# Altium project 解调板.PrjPCB
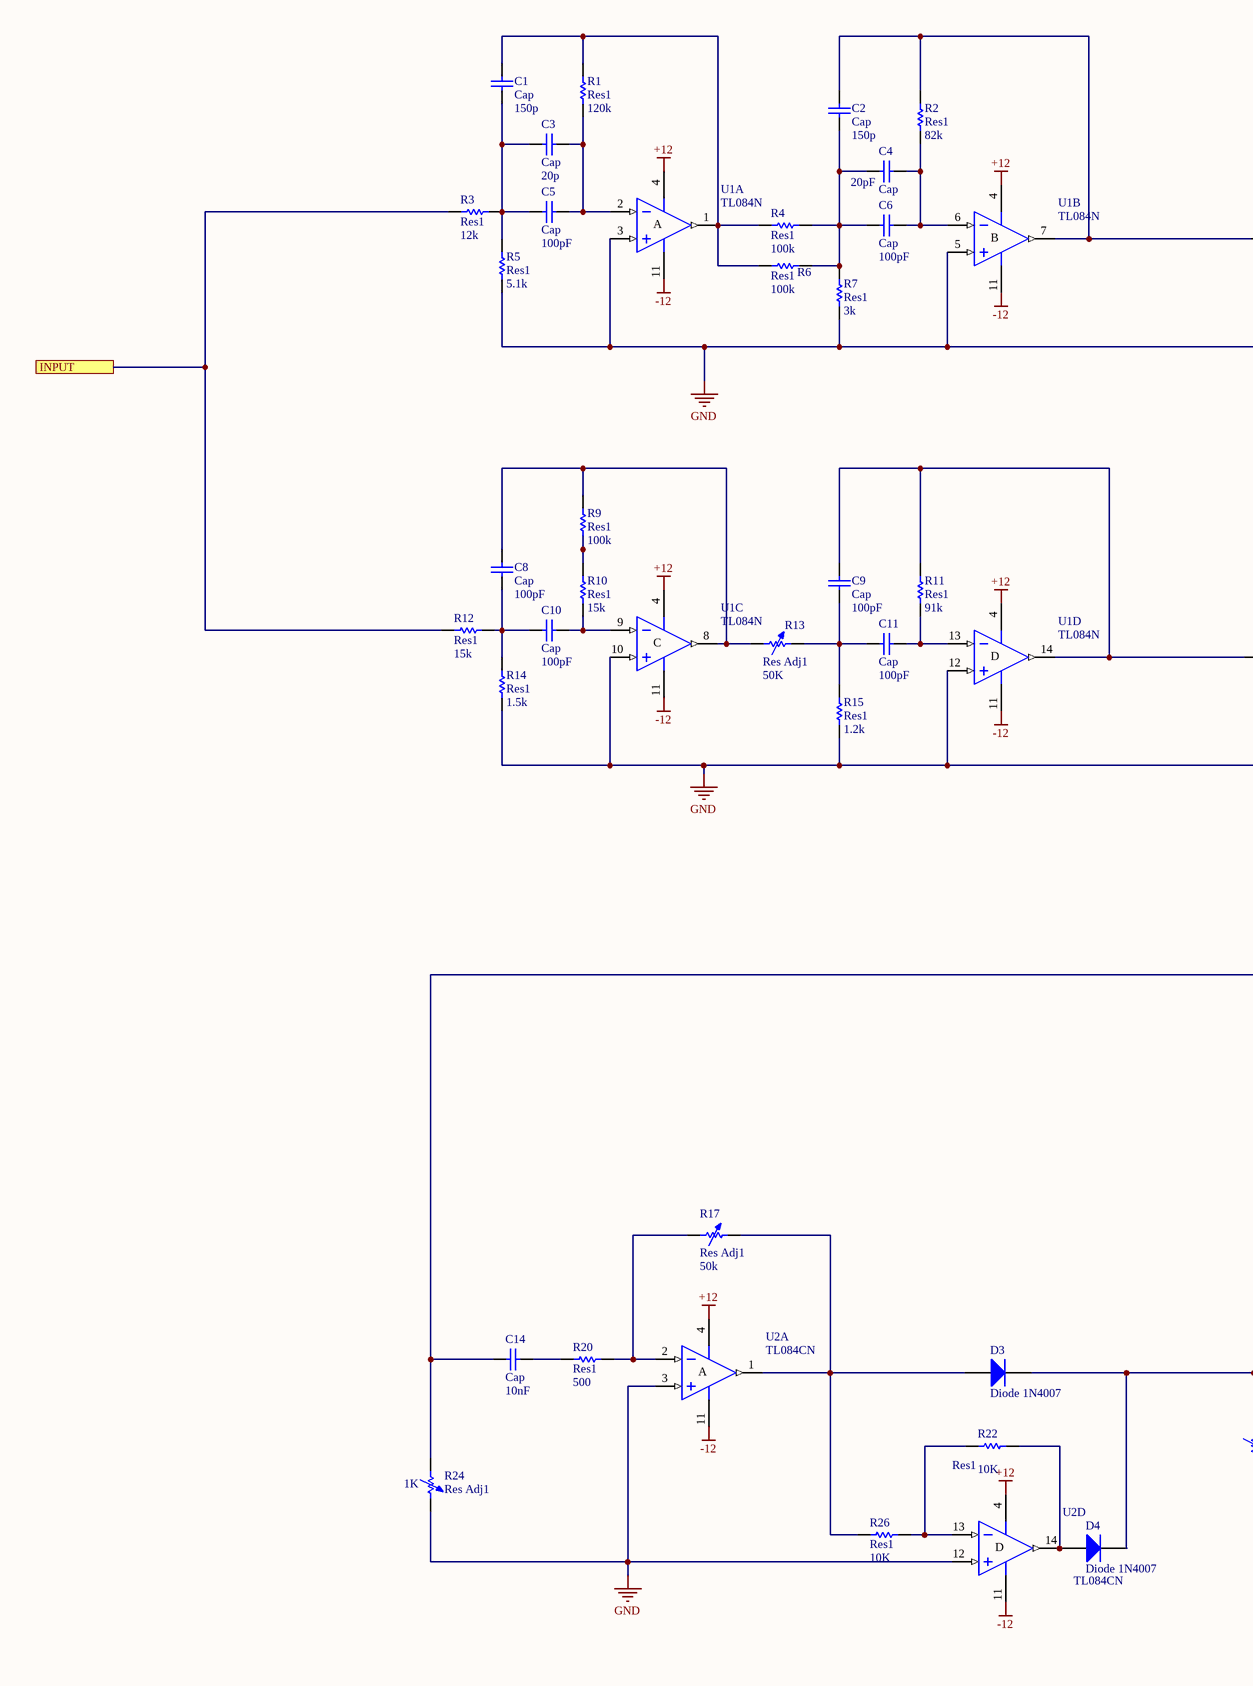
[diagram p0: 解调板原理图.SchDoc, left]
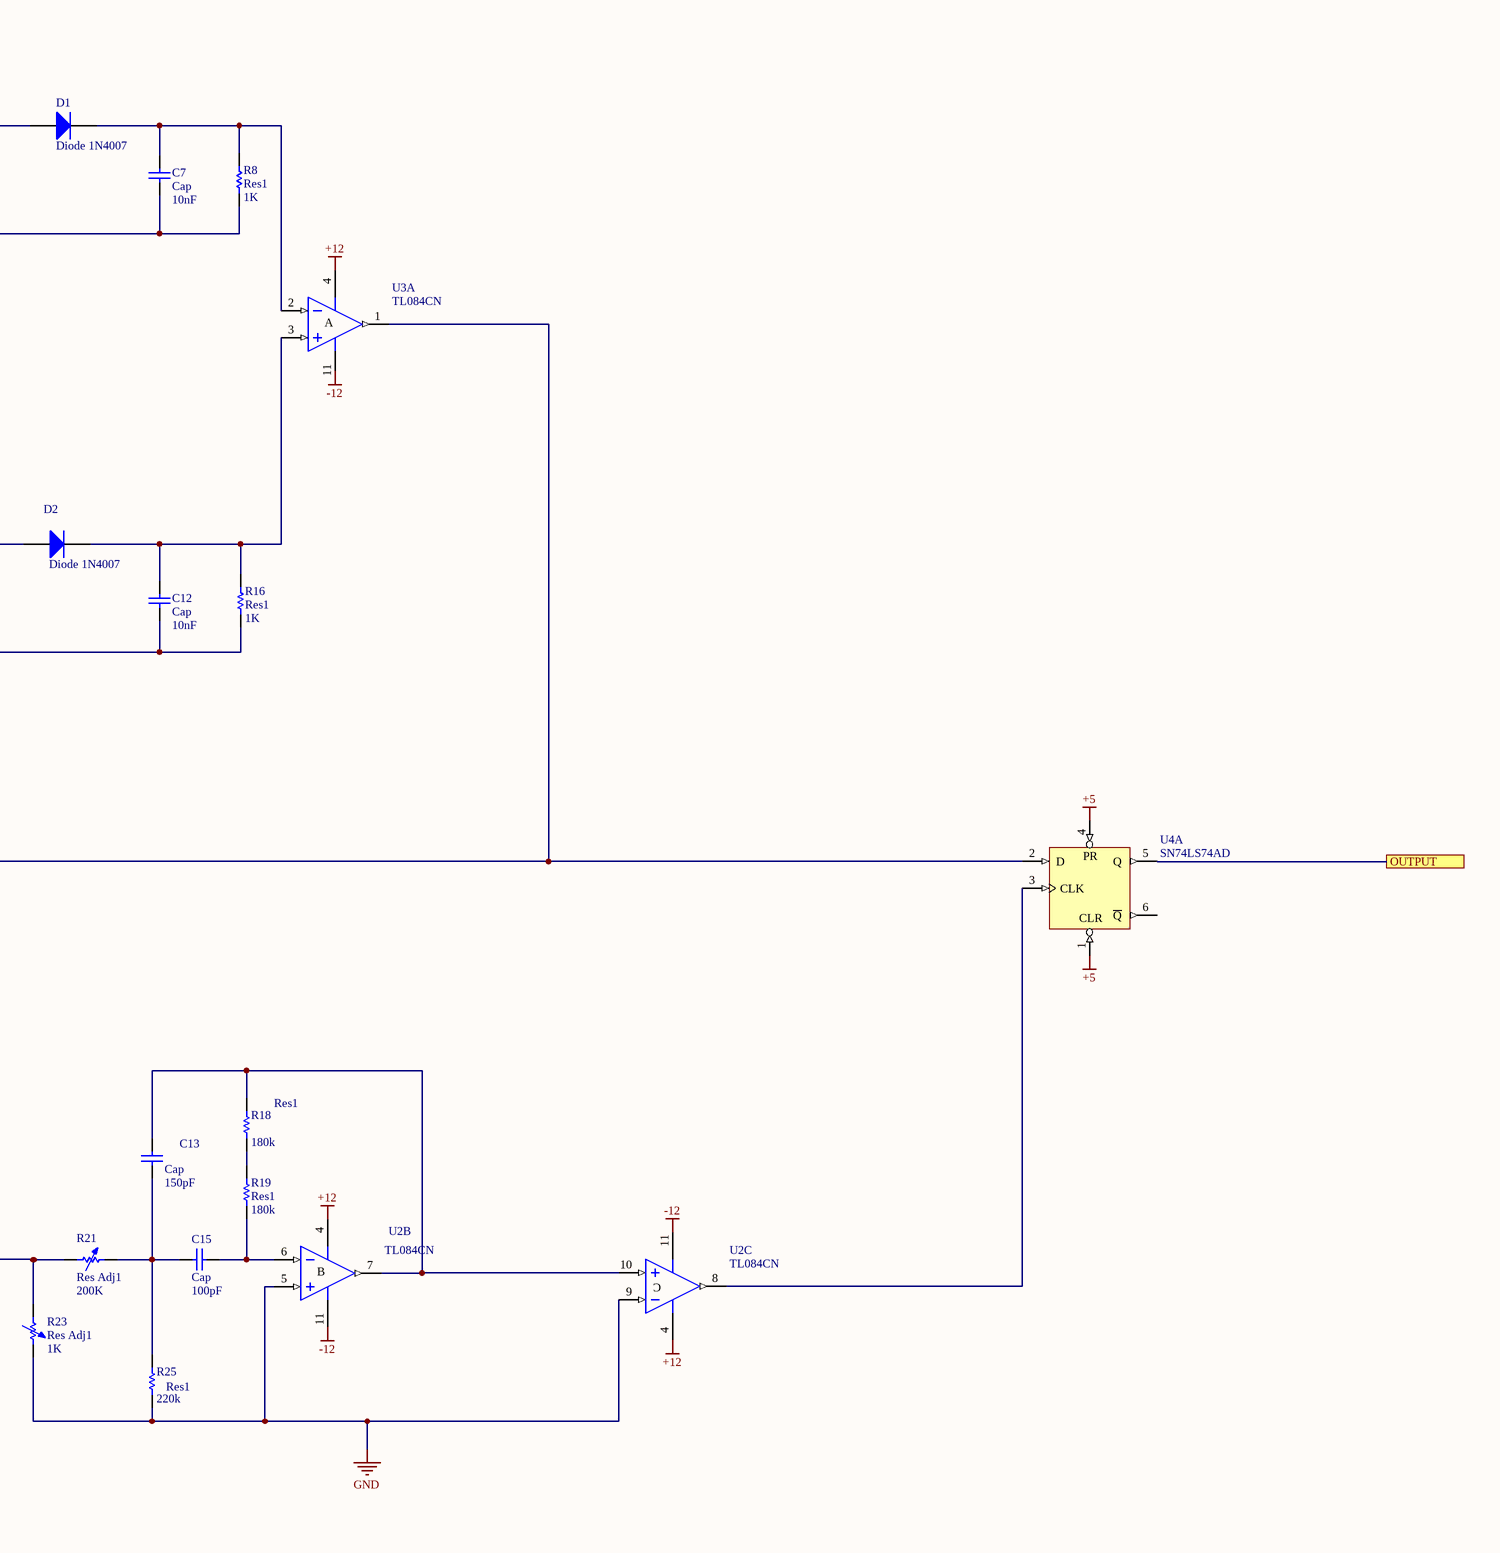
[diagram p1: 解调板原理图.SchDoc, right]
1 sheet, 49 parts. Net scope: flat (ports and power ports of the same name join across sheets).
Board file: 解调板PCB.PcbDoc

## Sheet 解调板原理图.SchDoc
size A2

### Parts
C1  Cap  value 150p  [RAD-0.3]
C2  Cap  value 150p  [RAD-0.3]
C3  Cap  value 20p  [RAD-0.3]
C4  Cap  value 20pF  [RAD-0.3]
C5  Cap  value 100pF  [RAD-0.3]
C6  Cap  value 100pF  [RAD-0.3]
C7  Cap  value 10nF  [RAD-0.3]
C8  Cap  value 100pF  [RAD-0.3]
C9  Cap  value 100pF  [RAD-0.3]
C10  Cap  value 100pF  [RAD-0.3]
C11  Cap  value 100pF  [RAD-0.3]
C12  Cap  value 10nF  [RAD-0.3]
C13  Cap  value 150pF  [RAD-0.3]
C14  Cap  value 10nF  [RAD-0.3]
C15  Cap  value 100pF  [RAD-0.3]
D1  Diode 1N4007  [DO-41]
D2  Diode 1N4007  [DO-41]
D3  Diode 1N4007  [DO-41]
D4  Diode 1N4007  [DO-41]
R1  Res1  value 120k  [AXIAL-0.3]
R2  Res1  value 82k  [AXIAL-0.3]
R3  Res1  value 12k  [AXIAL-0.3]
R4  Res1  value 100k  [AXIAL-0.3]
R5  Res1  value 5.1k  [AXIAL-0.3]
R6  Res1  value 100k  [AXIAL-0.3]
R7  Res1  value 3k  [AXIAL-0.3]
R8  Res1  value 1K  [AXIAL-0.3]
R9  Res1  value 100k  [AXIAL-0.3]
R10  Res1  value 15k  [AXIAL-0.3]
R11  Res1  value 91k  [AXIAL-0.3]
R12  Res1  value 15k  [AXIAL-0.3]
R13  Res Adj1  value 50K  [AXIAL-0.7]
R14  Res1  value 1.5k  [AXIAL-0.3]
R15  Res1  value 1.2k  [AXIAL-0.3]
R16  Res1  value 1K  [AXIAL-0.3]
R17  Res Adj1  value 50k  [AXIAL-0.7]
R18  Res1  value 180k  [AXIAL-0.3]
R19  Res1  value 180k  [AXIAL-0.3]
R20  Res1  value 500  [AXIAL-0.3]
R21  Res Adj1  value 200K  [AXIAL-0.7]
R22  Res1  value 10K  [AXIAL-0.3]
R23  Res Adj1  value 1K  [AXIAL-0.7]
R24  Res Adj1  value 1K  [AXIAL-0.7]
R25  Res1  value 220k  [AXIAL-0.3]
R26  Res1  value 10K  [AXIAL-0.3]
U1  TL084N  [N014]  (parts A,B,C,D of 4)
U2  TL084CN  [DIP14]  (parts A,B,C,D of 4)
U3  TL084CN  [DIP14]  (part A of 4)
U4  SN74LS74AD  [D014_L]  (part A of 2)

### Ports
INPUT, OUTPUT

### Nets
+5: U4.1(CLR) U4.4(PR)
+12: U1.4(V+) U2.4(V+) U3.4(V+)
-12: U1.11(V-) U2.11(V-)
GND: C7.1 C12.1 R5.1 R7.1 R8.1 R14.1 R15.1 R16.1 R23.2 R24.2 R25.1 U1.3(IN+) U1.5(IN+) U1.10(IN+) U1.12(IN+) U2.3(IN+) U2.5(IN+) U2.9(IN-) U2.12(IN+) U4.7(GND)
VCC: U4.14(VCC)
NetC1_1: C1.1 C3.1 C5.1 R3.2 R5.2
NetC1_2: C1.2 R1.2 R4.1 R6.1 U1.1(OUT)
NetC2_1: C2.1 C4.1 C6.1 R4.2 R6.2 R7.2
NetC2_2: C2.2 D1.1(A) R2.2 U1.7(OUT)
NetC3_2: C3.2 C5.2 R1.1 U1.2(IN-)
NetC4_2: C4.2 C6.2 R2.1 U1.6(IN-)
NetC7_2: C7.2 D1.2(K) R8.2 U3.2(IN-)
NetC8_1: C8.1 C10.1 R12.2 R14.2
NetC8_2: C8.2 R9.2 R13.1 U1.8(OUT)
NetC9_1: C9.1 C11.1 R13.2 R15.2
NetC9_2: C9.2 D2.1(A) R11.2 U1.14(OUT)
NetC10_2: C10.2 R10.1 U1.9(IN-)
NetC11_2: C11.2 R11.1 U1.13(IN-)
NetC12_2: C12.2 D2.2(K) R16.2 U3.3(IN+)
NetC13_1: C13.1 C15.1 R21.2 R25.2
NetC13_2: C13.2 R18.2 U2.7(OUT) U2.10(IN+)
NetC14_1: C14.1 R24.1 U3.1(OUT) U4.2(D)
NetC14_2: C14.2 R20.1
NetC15_2: C15.2 R19.1 U2.6(IN-)
NetD3_1: D3.1(A) R17.2 R26.1 U2.1(OUT)
NetD3_2: D3.2(K) D4.2(K) R21.1 R23.1
NetD4_1: D4.1(A) R22.2 U2.14(OUT)
NetR3_1: R3.1 R12.1 ; port INPUT
NetR9_1: R9.1 R10.2
NetR17_1: R17.1 R20.2 U2.2(IN-)
NetR18_1: R18.1 R19.2
NetR22_1: R22.1 R26.2 U2.13(IN-)
NetU2_8: U2.8(OUT) U4.3(CLK)
NetU4_5: U4.5(Q) ; port OUTPUT

Not connected (* = marked no-connect by the designer): U3 11(V-); U4 6(~{Q})

### Notes on the sheet
- Labels drawn without touching a wire or pin: -12
- (in symbol TL084CN, part A) A
- (in symbol TL084CN, part B) B
- (in symbol TL084CN, part C) C
- (in symbol TL084CN, part D) D
- (in symbol TL084N, part A) A
- (in symbol TL084N, part B) B
- (in symbol TL084N, part C) C
- (in symbol TL084N, part D) D

### Library data of the parts
C1-C15 = Cap: Capacitor; Published: 8-Jun-2000; LatestRevisionDate: 17-Jul-2002; LatestRevisionNote: Re-released for DXP Platform.; PackageReference: RAD-0.3; Publisher: Altium Limited; PackageDescription: Radial Cap, Thru-Hole; 2 Leads; 0.3 in Pin Spacing
D1-D4 = Diode 1N4001: 1 Amp General Purpose Rectifier; Published: 8-Jun-2000; LatestRevisionDate: 17-Jul-2002; LatestRevisionNote: Re-released for DXP Platform.; DatasheetVersion: 1998; PackageVersion: Aug-1999; PackageReference: DO-41; Publisher: Altium Limited; PackageDescription: Diode, Axial; Body 5.2 x 2.7 mm (LxDia. max), Lead Dia. 0.86 mm (max); Code_JEDEC: DO-204-AL; ComponentLink1Description: Manufacturer Link; ComponentLink1URL: http://www.fairchildsemi.com/; ComponentLink2Description: Datasheet; ComponentLink2URL: http://www.fairchildsemi.com/ds/1N%2F1N4001.pdf
R1-R12 R14-R16 R18-R20 R22 R25 R26 = Res1: Resistor; Published: 8-Jun-2000; LatestRevisionDate: 17-Jul-2002; LatestRevisionNote: Re-released for DXP Platform.; PackageReference: AXIAL-0.3; Publisher: Altium Limited; PackageDescription: Axial Device, Thru-Hole; 2 Leads; 0.3 in Pin Spacing
R13 R17 R21 R23 R24 = Res Adj1: Variable Resistor; Set Position: 0.5; Published: 8-Jun-2000; LatestRevisionDate: 17-Jul-2002; LatestRevisionNote: Re-released for DXP Platform.; PackageReference: AXIAL-0.7; Publisher: Altium Limited; PackageDescription: Axial Device, Thru-Hole; 2 Leads; 0.7 in Pin Spacing
U1 = TL084N: JFET-Input Operational Amplifier; Published: 16-Jan-2001; LatestRevisionDate: 04-Mar-2005; LatestRevisionNote: Stylized 3D Model Added.; DatasheetVersion: Feb-1999; PackageVersion: Oct-1995; PackageReference: N014; Publisher: Altium Limited; PackageDescription: DIP; 14 Leads; Row Spacing 7.62 mm; Pitch 2.54 mm; ComponentLink1Description: Manufacturer Link; ComponentLink1URL: http://www.ti.com/; ComponentLink2Description: Datasheet; ComponentLink2URL: http://www-s.ti.com/sc/ds/tl084.pdf
U2 U3 = TL084CN: General-Purpose J-FET Quad Operational Amplifier; Published: 24-Aug-2001; LatestRevisionDate: 06-Jun-2005; LatestRevisionNote: Stylized 3D Model Added.; DatasheetVersion: Jan-1999; PackageVersion: Jan-1997; PackageReference: DIP14; Publisher: Altium Limited; PackageDescription: DIP; 14 Leads; Row Spacing 7.62 mm; Pitch 2.54 mm; ComponentLink1Description: Manufacturer Link; ComponentLink1URL: http://www.st.com/; ComponentLink2Description: Datasheet; ComponentLink2URL: http://www.st.com/stonline/products/literature/ds/2301/tl084.pdf
U4 = SN74LS74AD: Dual D-Type Positive-Edge-Triggered Flip-Flop with Preset and Clear; Published: 8-Jun-2000; LatestRevisionDate: 13-Apr-2006; LatestRevisionNote: IPC-7351 Footprint Added.; DatasheetVersion: Mar-1988; PackageVersion: Jan-1998; PackageReference: D014; Publisher: Altium Limited; PackageDescription: 14-Pin Small Outline Integrated Circuit 1.27 mm Pitch; Code_IPC: SOIC127P600-14; ComponentLink1Description: Manufacturer Link; ComponentLink1URL: http://www.ti.com/; ComponentLink2Description: Datasheet; ComponentLink2URL: http://www-s.ti.com/sc/ds/sn74ls74a.pdf